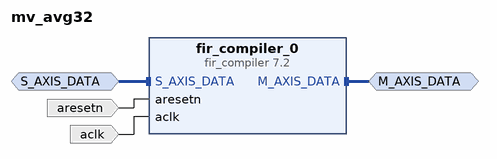
[diagram p0: block diagram of the top level]
# Vivado block design mv_avg32, xc7z045ffg900-2, Vivado 2018.3
create_bd_design mv_avg32

create_bd_intf_port -mode Slave -vlnv xilinx.com:interface:axis_rtl:1.0 S_AXIS_DATA
set_property -dict [list \
  CONFIG.FREQ_HZ 200000000 \
  CONFIG.HAS_TKEEP 0 \
  CONFIG.HAS_TLAST 0 \
  CONFIG.HAS_TREADY 1 \
  CONFIG.HAS_TSTRB 0 \
  CONFIG.LAYERED_METADATA undef \
  CONFIG.TDATA_NUM_BYTES 4 \
  CONFIG.TDEST_WIDTH 0 \
  CONFIG.TID_WIDTH 0 \
  CONFIG.TUSER_WIDTH 0 \
] [get_bd_intf_ports S_AXIS_DATA]
create_bd_intf_port -mode Master -vlnv xilinx.com:interface:axis_rtl:1.0 M_AXIS_DATA
set_property -dict {CONFIG.FREQ_HZ 200000000} [get_bd_intf_ports M_AXIS_DATA]
create_bd_port -dir I -type rst aresetn
create_bd_port -dir I -type clk aclk
set_property -dict {CONFIG.FREQ_HZ 200000000} [get_bd_ports aclk]

create_bd_cell -type ip -vlnv xilinx.com:ip:fir_compiler:7.2 fir_compiler_0
set_property -dict [list \
  CONFIG.BestPrecision true \
  CONFIG.CoefficientVector 0.03125,0.03125,0.03125,0.03125,0.03125,0.03125,0.03125,0.03125,0.03125,0.03125,0.03125,0.03125,0.03125,0.03125,0.03125,0.03125,0.03125,0.03125,0.03125,0.03125,0.03125,0.03125,0.03125,0.03125,0.03125,0.03125,0.03125,0.03125,0.03125,0.03125,0.03125,0.03125 \
  CONFIG.Coefficient_Fractional_Bits 6 \
  CONFIG.Coefficient_Sets 1 \
  CONFIG.Coefficient_Sign Unsigned \
  CONFIG.Coefficient_Structure Symmetric \
  CONFIG.Coefficient_Width 2 \
  CONFIG.ColumnConfig 2 \
  CONFIG.Filter_Architecture Systolic_Multiply_Accumulate \
  CONFIG.Has_ARESETn true \
  CONFIG.M_DATA_Has_TREADY false \
  CONFIG.Number_Paths 2 \
  CONFIG.Output_Rounding_Mode Symmetric_Rounding_to_Infinity \
  CONFIG.Output_Width 16 \
  CONFIG.Quantization Quantize_Only \
  CONFIG.RateSpecification Input_Sample_Period \
  CONFIG.S_DATA_Has_FIFO true \
  CONFIG.SamplePeriod 8 \
] [get_bd_cells fir_compiler_0]

# ---- connections ----

connect_bd_intf_net [get_bd_intf_ports S_AXIS_DATA] [get_bd_intf_pins fir_compiler_0/S_AXIS_DATA]
connect_bd_intf_net [get_bd_intf_ports M_AXIS_DATA] [get_bd_intf_pins fir_compiler_0/M_AXIS_DATA]
connect_bd_net [get_bd_ports aresetn] [get_bd_pins fir_compiler_0/aresetn]
connect_bd_net [get_bd_ports aclk] [get_bd_pins fir_compiler_0/aclk]

validate_bd_design
save_bd_design
